# Altium schematic sheet Sheet1.SchDoc
size A
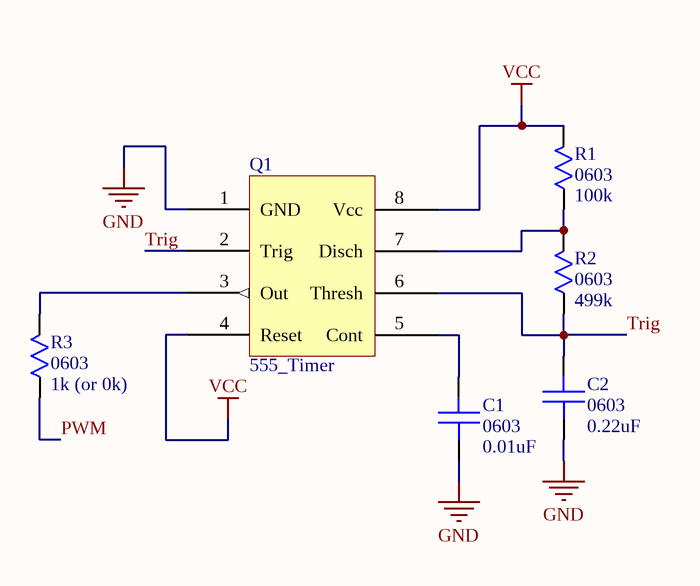
[diagram p0: Sheet1.SchDoc]

## Parts
C1  0603  value 0.01uF  [0603]
C2  0603  value 0.22uF  [0603]
Q1  555_Timer  [DIP8]
R1  0603  value 100k  [0603]
R2  0603  value 499k  [0603]
R3  0603  value 1k (or 0k)  [0603]

## Nets
GND: C1.1 C2.1 Q1.1(GND)
VCC: Q1.4(Reset) Q1.8(Vcc) R1.2
PWM: R3.1
Trig: C2.2 Q1.2(Trig) Q1.6(Thresh) R2.1
NetC1_2: C1.2 Q1.5(Cont)
NetQ1_3: Q1.3(Out) R3.2
NetQ1_7: Q1.7(Disch) R1.1 R2.2

## Library data of the parts
C1 C2 = Capacitor: 0603 capacitor
Q1 = 555_Timer_PDIP
R1-R3 = Resistor: 0603 resistor